# EasyEDA Pro project DRV8210PDSGR_2ways.eprj

# Schematic Schematic1
Create Date: 2023-11-28; Page Name: P1; Project Name: DRV8210PDSGR_2ways; Schematic Name: Schematic1; Update Date: 2023-11-28; Company: 嘉立创EDA; Page Size: A4; Version: V1.0
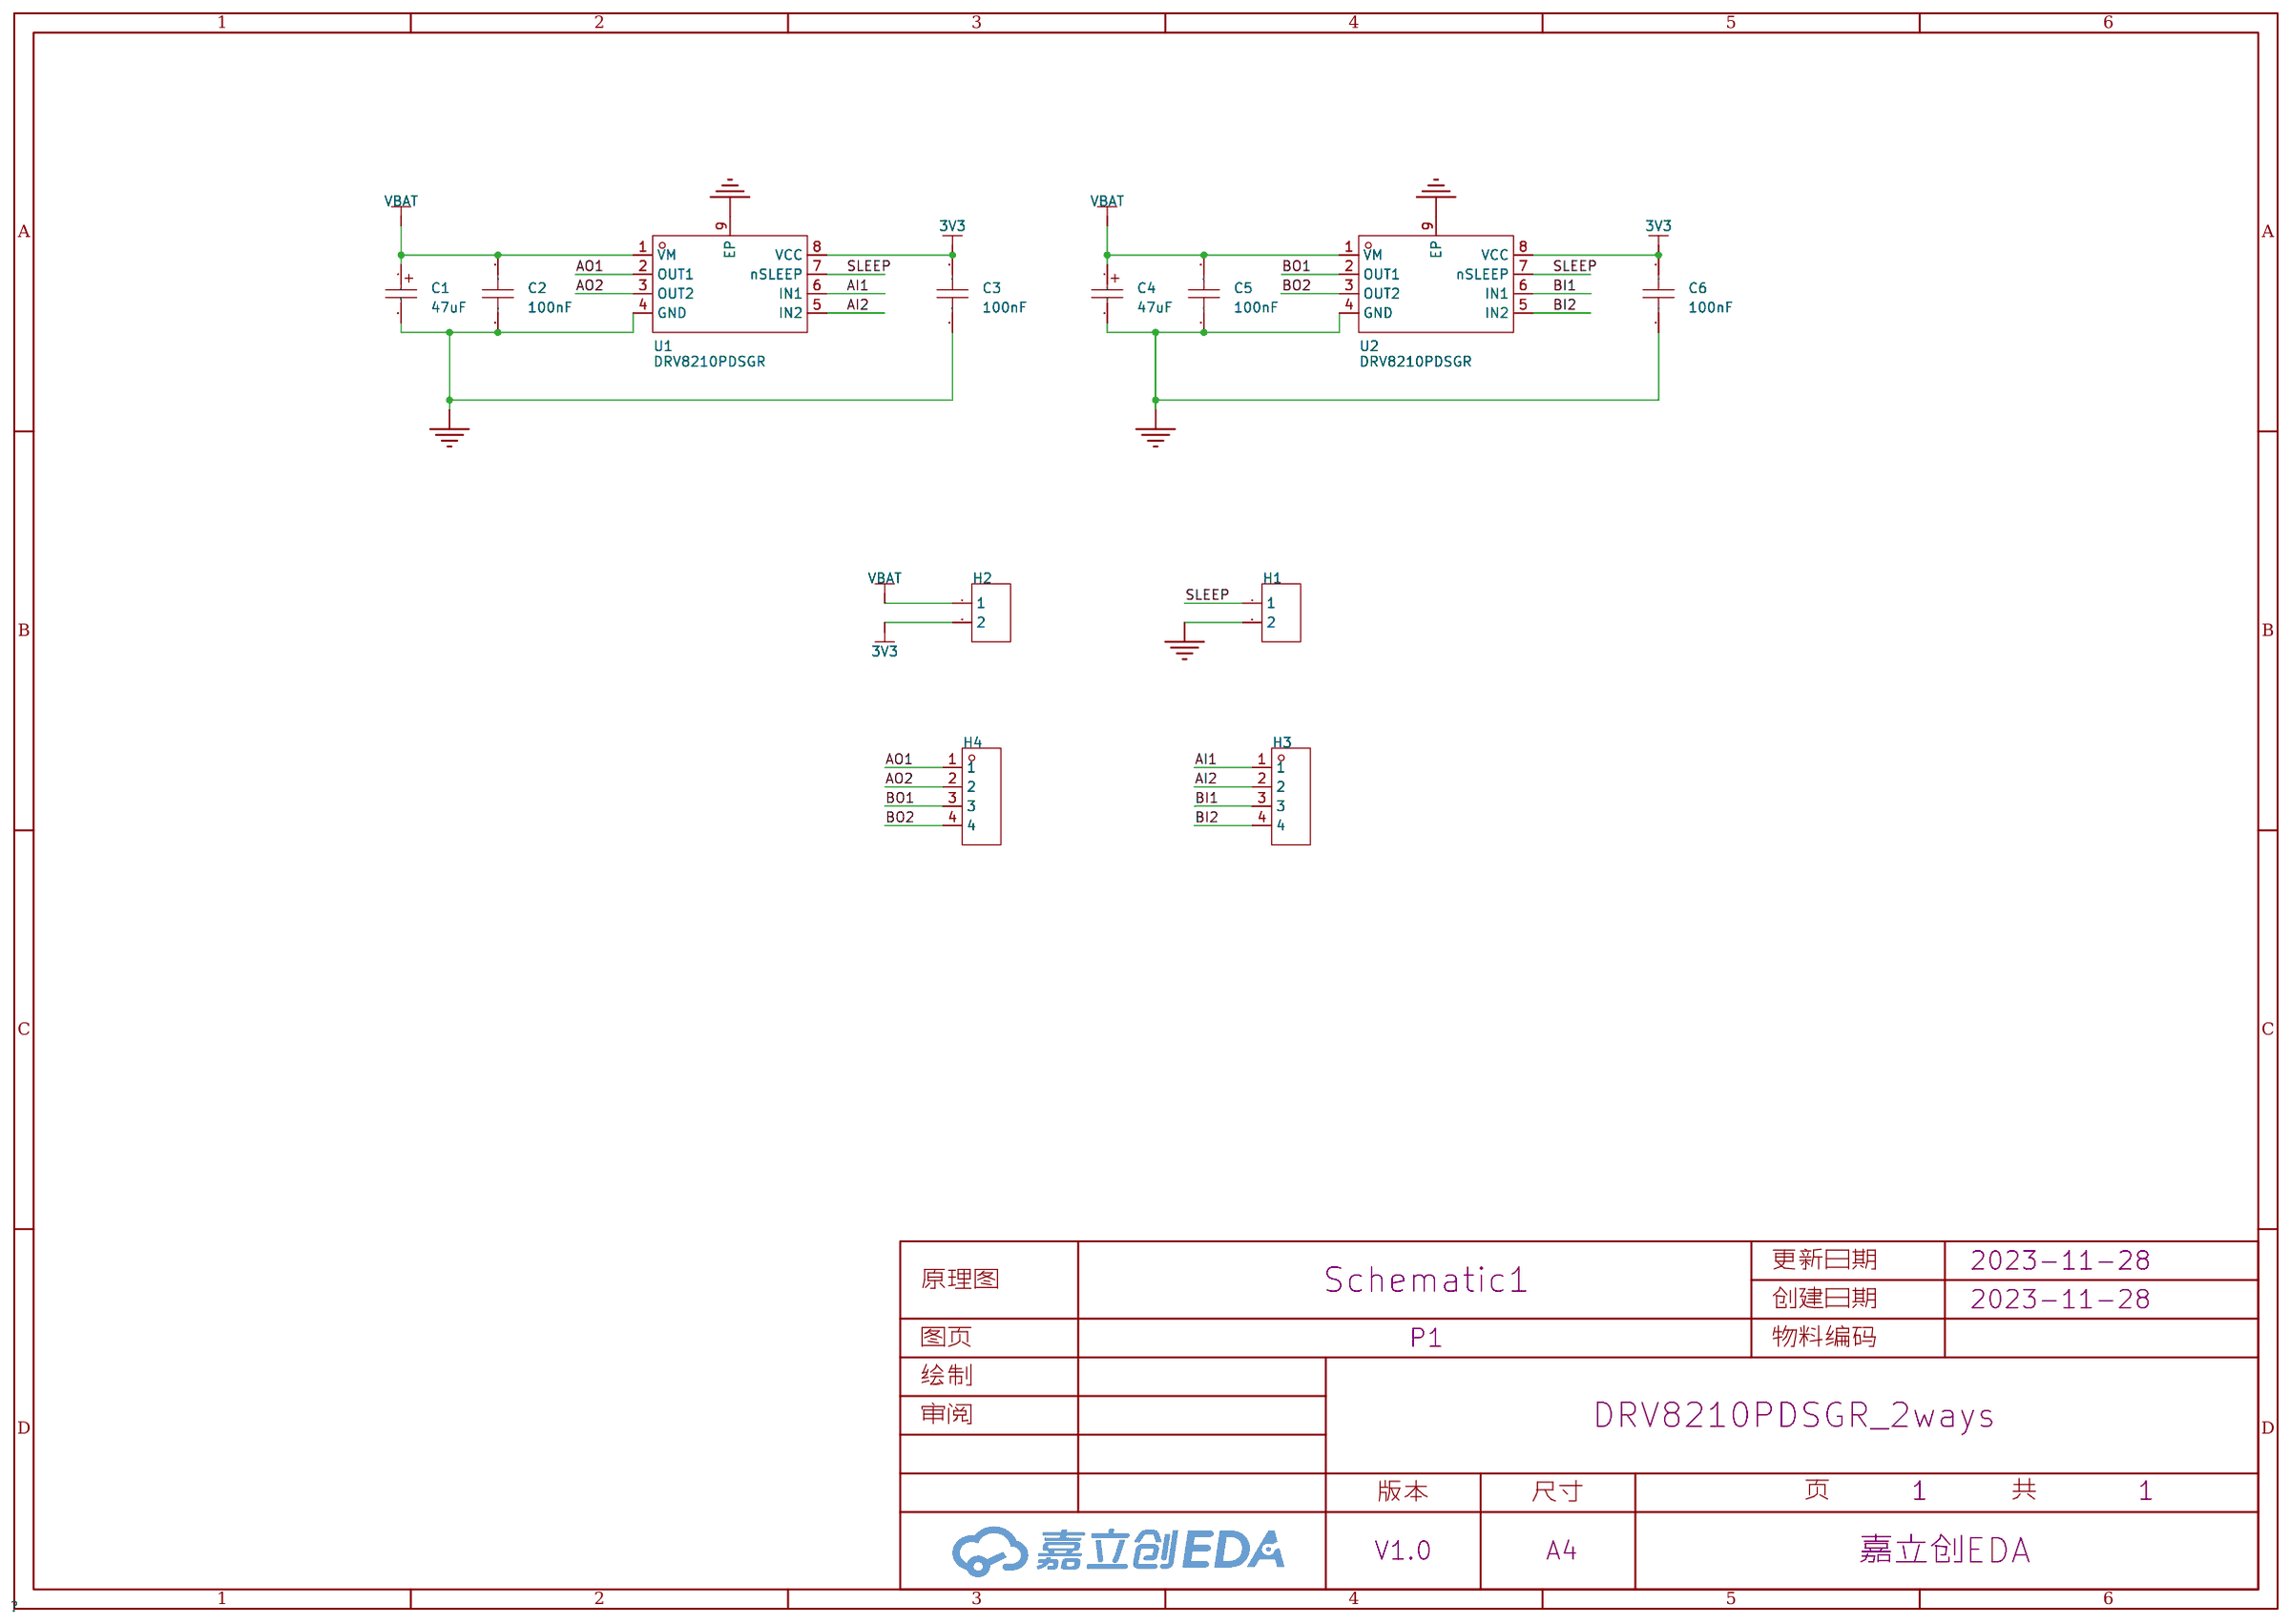
[diagram p0: schematic sheet]

## Parts
C1  47uF  [CAP-SMD_L3.5-W2.8-R-RD]
C2  100nF  [C0402]
C3  100nF  [C0402]
C4  47uF  [CAP-SMD_L3.5-W2.8-R-RD]
C5  100nF  [C0402]
C6  100nF  [C0402]
H1  -  [HDR-TH_2P-P2.54-V-F]
H2  -  [HDR-TH_2P-P2.54-V-F]
H3  -  [HDR-TH_4P-P2.54-V-F]
H4  -  [HDR-TH_4P-P2.54-V-F]
U1  DRV8210PDSGR  [WSON-8_L2.0-W2.0-P0.50-TL-EP]
U2  DRV8210PDSGR  [WSON-8_L2.0-W2.0-P0.50-TL-EP]

## Library data of the parts
C1 C4 = CA45-B010K476T: 容值:47uF;精度:±10%;额定电压:10V;等效串联电阻:1Ω@100kHz;; LCSC Part Name: 47uF ±10% 10V; Supplier Part: C123253; Manufacturer: 湘怡中元/湘江; Supplier Footprint: CASE-B-3528; JLCPCB Part Class: 扩展库; Datasheet: https://atta.szlcsc.com/upload/public/pdf/source/20181017/C123253_E44F021CD80332E438026884F943F9F2.pdf; Supplier: LCSC; Tolerance: ±10%; Rated Voltage: 10V; Equivalent Series Resistance(ESR): 1Ω@100kHz; Operating Temperature: -55℃~+125℃
C2 C3 C5 C6 = CAP_0402: Supplier Footprint: 0402
H1 H2 = HDR-F_2.54_1x2P: Supplier Part: C49661; Supplier Footprint: 插件
H3 H4 = HDR-F_2.54_1x4P: Supplier Part: C2718488; Supplier Footprint: 插件
U1 U2 = DRV8210PDSGR: 类型:有刷直流电机;电源电压:1.65V~12V;输出电流:1.76A;接口:PWM;; LCSC Part Name: 1.76A 具有低功耗睡眠模式的H 桥电机驱动器 PWM 控制 12V; Supplier Part: C5218852; Manufacturer: TI(德州仪器); Supplier Footprint: WSON-8(2x2); JLCPCB Part Class: 扩展库; Datasheet: https://www.ti.com/cn/lit/gpn/drv8210p; Supplier: LCSC; Type: 有刷直流电机; Supply Voltage: 1.65V~12V; Output Current: 1.76A; Interface: PWM; On Resistance: 1.05Ω; Operating Temperature: -40℃~+125℃@(Ta)

## Nets
3V3: C3.2 C6.2 H2.2 U1.8(VCC) U2.8(VCC)
GND: C1.2 C2.1 C3.1 C4.2 C5.1 C6.1 H1.2 U1.4(GND) U1.9(EP) U2.4(GND) U2.9(EP)
VBAT: C1.1 C2.2 C4.1 C5.2 H2.1 U1.1(VM) U2.1(VM)
AI1: H3.1 U1.6(IN1)
AI2: H3.2 U1.5(IN2)
AO1: H4.1 U1.2(OUT1)
AO2: H4.2 U1.3(OUT2)
BI1: H3.3 U2.6(IN1)
BI2: H3.4 U2.5(IN2)
BO1: H4.3 U2.2(OUT1)
BO2: H4.4 U2.3(OUT2)
SLEEP: H1.1 U1.7(nSLEEP) U2.7(nSLEEP)

# Board PCB1
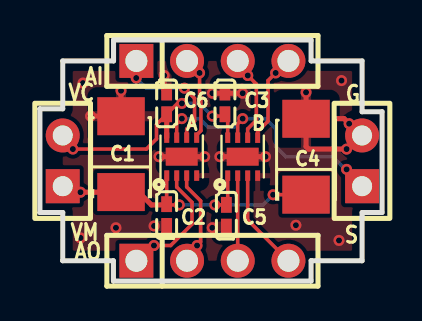
[diagram p1: board, top side]
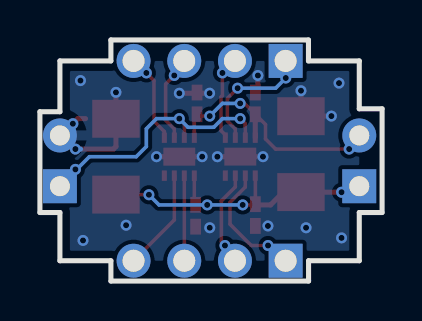
[diagram p2: board, bottom side, seen from below]

Outline 17.15 x 12.07 mm; copper layers: Top Layer, Bottom Layer. Coordinates in mm from the lower left corner of the outline.
Outline path: 0,8.62 0,3.43 1.14,3.43 1.14,1.02 3.68,1.02 3.68,0 13.59,0 13.59,1.02 16.14,1.02 16.14,3.43 17.15,3.43 17.15,8.47 16.14,8.47 16.14,11.02 13.59,11.02 13.59,12.07 3.69,12.07 3.69,11.02 1.14,11.02 1.14,8.62 0,8.62
Stack: Top Layer 0.035mm / Dielectric1 1.51mm FR4 er 4.5 / Bottom Layer 0.035mm

## Design rules (mm)
template: 自定义配置
spacing copperThickness1oz (default): track to track 0.102, other pairs 0 to 0.3
spacing copperThickness2oz: track to track 0.203, other pairs 0.152 to 0.3
track width copperThickness1oz (default): min 0.127, default 0.254, max 2.54
track width copperThickness2oz: min 0.203, default 0.254, max 2.54
differential pair differentialPair (default): width min 0.127, default 0.254, max 2.54; gap min 0.152, default 0.152
via viaSize (default): diameter min 0.5, default 0.551, max 10; hole min 0.3, default 0.305, max 6.299

## Placement (name value [footprint] x y rotation side)
A  DRV8210PDSGR  [WSON-8_L2.0-W2.0-P0.50-TL-EP]  7.1 6.23 90 top
B  DRV8210PDSGR  [WSON-8_L2.0-W2.0-P0.50-TL-EP]  10.16 6.22 90 top
C1  47uF  [CAP-SMD_L3.5-W2.8-R-RD]  4.06 6.35 270 top
C2  100nF  [C0402]  6.35 3.3 90 top
C3  100nF  [C0402]  9.27 8.89 270 top
C4  47uF  [CAP-SMD_L3.5-W2.8-R-RD]  13.34 6.22 270 top
C5  100nF  [C0402]  9.34 3.27 90 top
C6  100nF  [C0402]  6.35 8.89 270 top
H1  -  [HDR-TH_2P-P2.54-V-F]  16.14 6.02 90 top
H2  -  [HDR-TH_2P-P2.54-V-F]  1.14 6.02 90 top
H3  -  [HDR-TH_4P-P2.54-V-F]  8.64 11.02 0 top
H4  -  [HDR-TH_4P-P2.54-V-F]  8.64 1.02 0 top

## Footprints (pads in the part's own frame, mm; a bottom-side part is the same pattern mirrored in y, then rotated)
C0402
  rect 0.79x0.54 smd: 1(-0.545,0) 2(0.545,0)
CAP-SMD_L3.5-W2.8-R-RD
  rect 1.9x2.376 smd: 1(1.899,0) 2(-1.899,0)
HDR-TH_2P-P2.54-V-F
  rect 1.7x1.7 hole 1: 1(-1.27,0)
  round 1.7 hole 1: 2(1.27,0)
HDR-TH_4P-P2.54-V-F
  rect 1.7x1.7 hole 1.1: 1(-3.81,0)
  round 1.7 hole 1.1: 2(-1.27,0) 3(1.27,0) 4(3.81,0)
WSON-8_L2.0-W2.0-P0.50-TL-EP
  rect 0.521x0.25 smd: 1(-0.95,0.75) 2(-0.95,0.25) 3(-0.95,-0.25) 4(-0.95,-0.75) 5(0.95,-0.75) 6(0.95,-0.25) 7(0.95,0.25) 8(0.95,0.75)
  rect 0.9x1.6 smd: 9(0,0)

## Nets
3V3: A.8 B.8 C3.2 C6.2 H2.2
GND: A.4 A.9 B.4 B.9 C1.2 C2.1 C3.1 C4.2 C5.1 C6.1 H1.2
VBAT: A.1 B.1 C1.1 C2.2 C4.1 C5.2 H2.1
AI1: A.6 H3.1
AI2: A.5 H3.2
AO1: A.2 H4.1
AO2: A.3 H4.2
BI1: B.6 H3.3
BI2: B.5 H3.4
BO1: B.2 H4.3
BO2: B.3 H4.4
SLEEP: A.7 B.7 H1.1

## Via types
v1: diameter 0.551, hole 0.305, Top Layer to Bottom Layer, 33 vias
v2: diameter 0.55, hole 0.305, Top Layer to Bottom Layer, 4 vias

## Routing (per net, layer and track width the routed paths; a pad name or vN(x,y) marks a point on that pad's centre or on a via; arc(x,y) is an arc through that point)
3V3: length 12.6
  Top Layer w0.178: v2(8.64,8.26) 9.18,8.26 C3.2 9.41,8.21 B.8 ; v2(7.11,8.89) 6.9,8.89 C6.2 5.84,7.84 5.84,7.11 5.33,6.6 v2(1.65,6.6)
  Top Layer w0.254: C6.2 6.35,8.34 A.8
  Bottom Layer w0.178: v2(8.64,8.26) 8,8.89 v2(7.11,8.89) ; H2.2 1.14,7.11 v2(1.65,6.6)
GND: length 16.8
  Top Layer w0.254: H1.2 15.46,6.6 v1(15.37,6.6) 13.46,6.6 13.34,6.73 C4.2 v1(13.34,9.44) ; v1(8.64,9.4) 9.24,9.4 C3.1 9.31,9.4 v1(10.16,9.4) ; v1(2.54,8.26) 4.06,8.26 C1.2 v1(4.06,9.53) ; v1(5.97,6.22) 7.1,6.22 A.9 7.11,6.22 v1(8.25,6.22) ; v1(6.22,10.29) 6.22,9.56 C6.1 ; v1(15.49,7.87) 15.24,8.13 14.86,8.13 ; v1(11.3,6.22) B.9 v1(9.02,6.22)
  Bottom Layer w0.254: v1(2.54,8.26) 2.67,8.26 ; v1(15.37,6.6) 15.11,6.6
  vias: v1(2.03,2.16) v1(2.16,9.91) v1(3.81,2.67) v1(5.72,2.76) v1(8.64,2.67) v1(12.83,2.79) v1(14.99,2.03) v1(15.11,10.03)
VBAT: length 16.4
  Top Layer w0.178: C2.2 6.35,5.27 A.1 ; 6.31,3.81 v1(6.99,3.81) ; C4.1 11.69,4.32 v1(11.68,4.32) ; v1(8.76,3.81) 9.34,3.81 C5.2 9.41,3.88 B.1
  Top Layer w0.254: 4.06,4.45 C1.1 ; 4.06,4.45 4.95,4.45 5.59,3.81 6.31,3.81 C2.2 ; 4.06,4.45 v1(2.03,4.45) 1.73,4.75 H2.1
  Bottom Layer w0.178: v1(11.68,4.32) 11.18,3.81 v1(8.76,3.81) v1(6.99,3.81)
AI1: length 5.5
  Top Layer w0.178: v1(7.24,9.65) 7.75,9.14 7.75,8 7.35,7.61 A.6
  Bottom Layer w0.178: v1(7.24,9.65) 5.33,9.65 v1(4.83,10.16)
AI2: length 3.4
  Top Layer w0.178: A.5 7.85,7.31 8.07,7.53 8.07,9.21 8,9.28 v1(8,10.41)
AO1: length 5.2
  Top Layer w0.178: A.2 6.85,4.7 7.62,3.94 7.62,2.84 6.55,1.78 v1(5.72,1.78)
  Bottom Layer w0.178: v1(5.72,1.78) 5.84,1.78
AO2: length 4.8
  Top Layer w0.178: H4.2 7.87,1.52 v1(7.87,1.78) 8.05,1.96 8.05,4.01 7.35,4.71 A.3
BI1: length 4.4
  Top Layer w0.178: H3.3 10.41,10.52 v1(10.41,10.29) 10.85,9.86 10.85,8.05 10.41,7.62 B.6
BI2: length 4.5
  Top Layer w0.178: v1(11.81,10.41) 11.43,10.03 11.43,8 10.91,7.48 B.5
  Bottom Layer w0.178: H3.4 12.41,11.02 v1(11.81,10.41)
BO1: length 4.3
  Top Layer w0.178: B.2 9.91,1.02 H4.3
BO2: length 5.1
  Top Layer w0.178: H4.4 10.41,3.06 B.3
SLEEP: length 13.2
  Top Layer w0.178: B.7 9.91,7.88 v1(10.16,8.13) ; H1.1 15.37,5.52 v1(15.37,5.59) ; A.7 6.85,7.87 v2(7.11,8.13)
  Bottom Layer w0.178: 15.17,5.71 14.67,6.22 12.32,6.22 11.81,6.73 11.81,7.62 11.3,8.13 v1(10.16,8.13) 9.73,7.7 8.43,7.7 8,8.13 v2(7.11,8.13)

## Copper pours and planes (outline as drawn; the poured copper is in the pictures)
GND on Top Layer: 1.14,11.02 16.14,11.02 16.14,1.02 1.14,1.02
GND on Bottom Layer: 1.14,11.02 16.14,11.02 16.14,1.02 1.14,1.02

## Text on the board
Top Silkscreen Layer: AO | AI | VC | VM | S | G
